# Altium schematic sheet PowerSupply.SchDoc
size A4; Organization: Autobot Limited; Address1: 96, boulevard Bessiere; Address4: 75017 PARIS
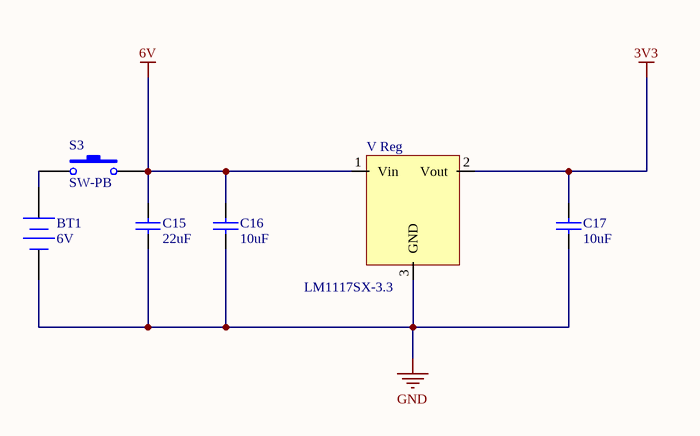
[diagram p0: PowerSupply.SchDoc]

## Parts
BT1  6V  [BAT-2]
C15  22uF  [CAPC1608N]
C16  10uF  [CAPC1608N]
C17  10uF  [CAPC1608N]
S3  SW-PB  [SPST-2]
V_Reg  LM1117SX-3.3  [TO-263-3]

## Nets
3V3: C17.2 V_Reg.2(Vout)
6V: C15.2 C16.2 S3.2 V_Reg.1(Vin)
GND: BT1.2(-) C15.1 C16.1 C17.1 V_Reg.3(GND)
NetBT1_1: BT1.1(+) S3.1

## Notes on the sheet
- Title
- Size:
- Date:
- A4
- Number:
- Time:
- Revision:
- Sheet
- of
- File:

## Library data of the parts
BT1 = Battery: Multicell Battery; Fournisseur: Olimex; Published: 24-Mar-1999; LatestRevisionDate: 17-Jul-2002; LatestRevisionNote: Re-released for DXP Platform.; PackageReference: BAT-2; Publisher: Altium Limited; PackageDescription: Battery; 2 Leads; Value: 6V
C15-C17 = Cap: Capacitor; Published: 8-Jun-2000; LatestRevisionDate: 17-Jul-2002; LatestRevisionNote: Re-released for DXP Platform.; PackageReference: RAD-0.3; Publisher: Altium Limited; PackageDescription: Radial Cap, Thru-Hole; 2 Leads; 0.3 in Pin Spacing
  C15: Value: 22uF
  C16 C17: Value: 10uF
S3 = SW-PB: Switch; Fabricant: MULTICOMP; Fournisseur: Farnell; RefFabricant: R13-608C1-02-BB-9A; RefFournisseur: 1634617; Published: 24-Mar-1999; LatestRevisionDate: 17-Jul-2002; LatestRevisionNote: Re-released for DXP Platform.; PackageReference: SPST-2; Publisher: Altium Limited; PackageDescription: Switch; 2 Leads
V_Reg = LM1117SX-3.3: Fabricant: TEXAS INSTRUMENT; Fournisseur: Farnell; RefFabricant: LM1117SX-3.3/NOPB; RefFournisseur: 2323594